# EAGLE schematic tinyduino-driver (EAGLE 6.4)
DATABASE: ./../../../../../Components/TinyCircuits_Part_Database.txt
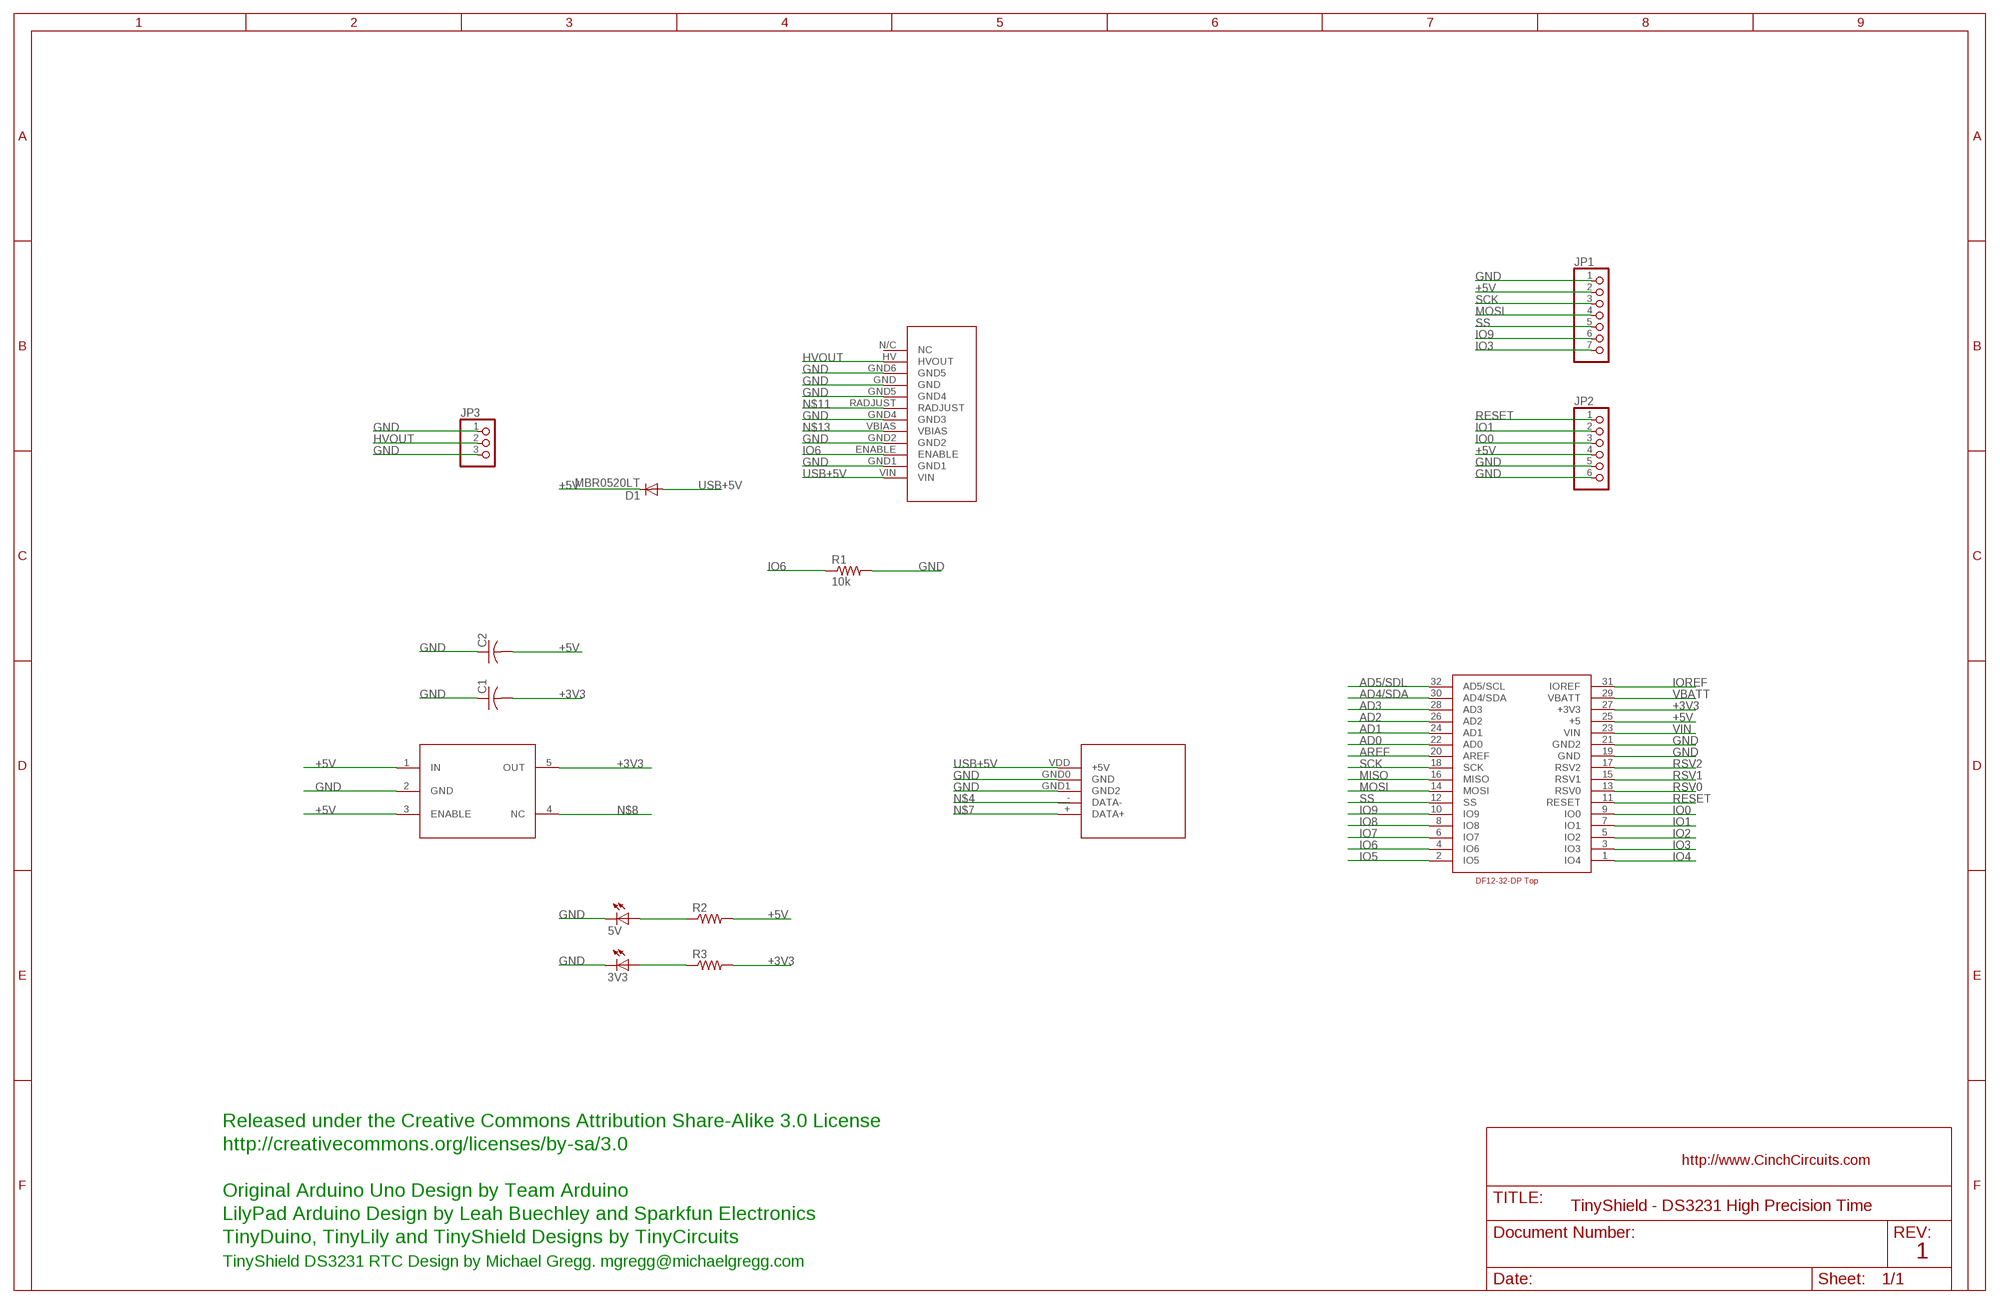
[diagram p0: schematic, sheet 1]

## Parts
3V3  LEDCHIPLED_0603  [CHIPLED_0603]
5V  LEDCHIPLED_0603  [CHIPLED_0603]
C1  C-USC0805  [C0805]
C2  C-USC0805  [C0805]
D1  MBR0520LT  [SOD123]
JP1  PINHD-1X7  [1X07]
JP2  PINHD-1X6  [1X06]
JP3  PINHD-1X3  [1X03]
R1  10k  R-US_R0805  [R0805]
R2  R-US_R0805  [R0805]
R3  R-US_R0805  [R0805]
U$2  HV-MODULE-EBAY  [NIIE-HV]
U$3  USB-MICRO-SMD  [CONNECTER_MINI_USB2]
U$4  3V3-LDO-TI  [SOT23-5]
U$5  TINYCIRCUITS-DF12-32-DS-BOTTOM  [TINYCIRCUITS_DF12-32-DS]

## Nets
+3V3: C1.2 R3.2 U$4.5(OUT) U$5.27(+3V3)
+5V: C2.2 D1.C JP1.2 JP2.4 R2.2 U$4.1(IN) U$4.3(ENABLE) U$5.25(+5)
AD0: U$5.22(AD0)
AD1: U$5.24(AD1)
AD2: U$5.26(AD2)
AD3: U$5.28(AD3)
AD4/SDA: U$5.30(AD4/SDA)
AD5/SDL: U$5.32(AD5/SCL)
AREF: U$5.20(AREF)
GND: 3V3.C 5V.C C1.1 C2.1 JP1.1 JP2.5 JP2.6 JP3.1 JP3.3 R1.2 U$2.GND U$2.GND1 U$2.GND2 U$2.GND4(GND3) U$2.GND5(GND4) U$2.GND6(GND5) U$3.GND0(GND) U$3.GND1(GND2) U$4.2(GND) U$5.19(GND) U$5.21(GND2)
HVOUT: JP3.2 U$2.HV(HVOUT)
IO0: JP2.3 U$5.9(IO0)
IO1: JP2.2 U$5.7(IO1)
IO2: U$5.5(IO2)
IO3: JP1.7 U$5.3(IO3)
IO4: U$5.1(IO4)
IO5: U$5.2(IO5)
IO6: R1.1 U$2.ENABLE U$5.4(IO6)
IO7: U$5.6(IO7)
IO8: U$5.8(IO8)
IO9: JP1.6 U$5.10(IO9)
IOREF: U$5.31(IOREF)
MISO: U$5.16(MISO)
MOSI: JP1.4 U$5.14(MOSI)
N$1: 3V3.A R3.1
N$2: 5V.A R2.1
N$7: U$3.+(DATA+)
N$8: U$4.4(NC)
N$11: U$2.RADJUST
N$13: U$2.VBIAS
RESET: JP2.1 U$5.11(RESET)
RSV0: U$5.13(RSV0)
RSV1: U$5.15(RSV1)
RSV2: U$5.17(RSV2)
SCK: JP1.3 U$5.18(SCK)
SS: JP1.5 U$5.12(SS)
USB+5V: D1.A U$2.VIN U$3.VDD(+5V)
VBATT: U$5.29(VBATT)
VIN: U$5.23(VIN)
Unconnected: U$2.N/C(NC) U$3.-(DATA-)

## Notes on the sheet
- Released under the Creative Commons Attribution Share-Alike 3.0 License
- http://creativecommons.org/licenses/by-sa/3.0
- Original Arduino Uno Design by Team Arduino
- TinyShield - DS3231 High Precision Time
- LilyPad Arduino Design by Leah Buechley and Sparkfun Electronics
- TinyDuino, TinyLily and TinyShield Designs by TinyCircuits
- 1
- TinyShield DS3231 RTC Design by Michael Gregg. mgregg@michaelgregg.com

## Library data of the parts
3V3 5V = adafruit:LED: LED OSRAM: - CHIPLED LG R971, LG N971, LY N971, LG Q971, LY Q971, LO R971, LY R971 LH N974, LH R974 LS Q976, LO Q976, LY Q976 LO Q996 - Hyper CHIPLED LW Q18S LB Q993, LB Q99A, LB R99A - SideLED LS A670, LO A670, LY A670, LG A670, LP A670 LB A673, LV A673, LT A673, LW A673 LH A674 LY A675 LS A676, LA A676, LO A676, LY A676, LW A676 LS A679, LY A679, LG A679 - Hyper Micro SIDELED® LS Y876, LA Y876, LO Y876, LY Y876 LT Y87S - SmartLED LW L88C, LW L88S LB L89C, LB L89S, LG L890 LS L89K, LO L89K, LY L89K LS L896, LA L896, LO L896, LY L896 - TOPLED LS T670, LO T670, LY T670, LG T670, LP T670 LSG T670, LSP T670, LSY T670, LOP T670, LYG T670 LG T671, LOG T671, LSG T671 LB T673, LV T673, LT T673, LW T673 LH T674 LS T676, LA T676, LO T676, LY T676, LB T676, LH T676, LSB T676, LW T676 LB T67C, LV T67C, LT T67C, LS T67K, LO T67K, LY T67K, LW E67C LS E67B, LA E67B, LO E67B, LY E67B, LB E67C, LV E67C, LT E67C LW T67C LS T679, LY T679, LG T679 LS T770, LO T770, LY T770, LG T770, LP T770 LB T773, LV T773, LT T773, LW T773 LH T774 LS E675, LA E675, LY E675, LS T675 LS T776, LA T776, LO T776, LY T776, LB T776 LHGB T686 LT T68C, LB T68C - Hyper Mini TOPLED® LB M676 - Mini TOPLED Santana® LG M470 LS M47K, LO M47K, LY M47K Source: http://www.osram.convergy.de/
C1 C2 = resistor:C-US: CAPACITOR, American symbol
D1 = diode:MBR0520LT: SCHOTTKY BARRIER RECTIFIER Source: http://onsemi.com .. MBR0520LT1-D.pdf
JP1 = pinhead:PINHD-1X7: PIN HEADER
JP2 = pinhead:PINHD-1X6: PIN HEADER
JP3 = pinhead:PINHD-1X3: PIN HEADER
R1-R3 = resistor:R-US_: RESISTOR, American symbol
U$2 = mgregg:HV-MODULE-EBAY
U$3 = mgregg:USB-MICRO-SMD
U$4 = mgregg:3V3-LDO-TI
U$5 = mgregg:TINYCIRCUITS-DF12-32-DS-BOTTOM